# Altium schematic sheet IMX7S_DEBUG.SchDoc
size A3
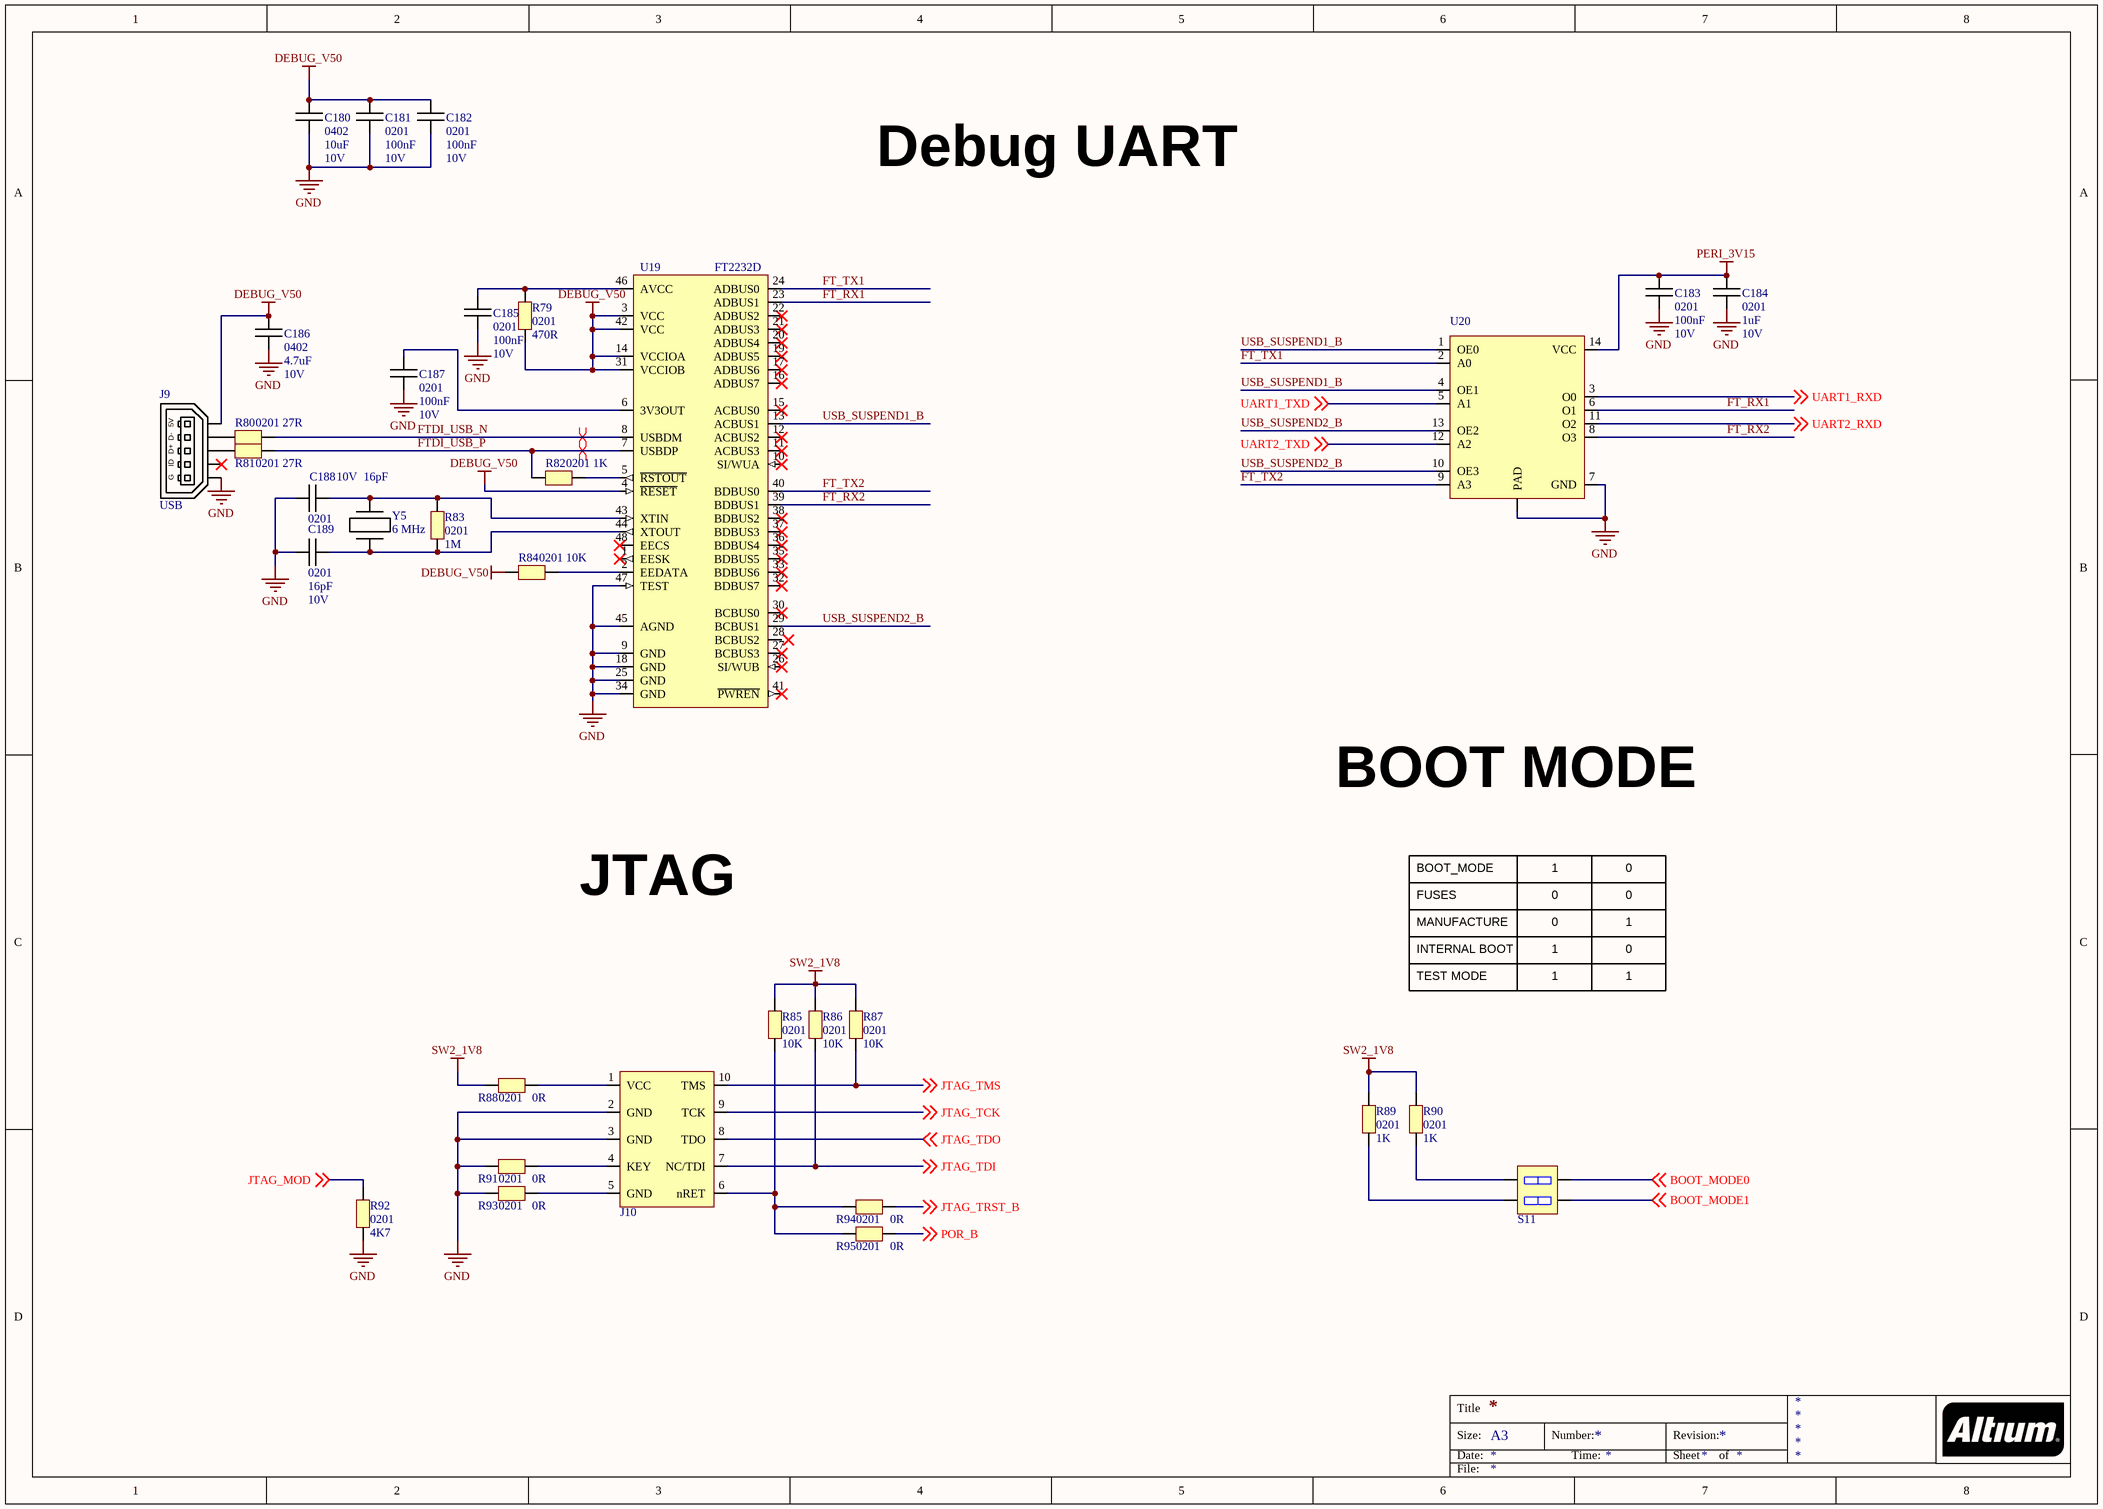
[diagram p0: IMX7S_DEBUG.SchDoc]

## Parts
C180  value 10uF  PACKAGE: 0402  VOLTAGE: 10V  [C0402]  (hidden comment: C0402)
C181  value 100nF  PACKAGE: 0201  VOLTAGE: 10V  [C0201]  (hidden comment: C0201)
C182  value 100nF  PACKAGE: 0201  VOLTAGE: 10V  [C0201]  (hidden comment: C0201)
C183  value 100nF  PACKAGE: 0201  VOLTAGE: 10V  [C0201]  (hidden comment: C0201)
C184  value 1uF  PACKAGE: 0201  VOLTAGE: 10V  [C0201]  (hidden comment: C0201)
C185  value 100nF  PACKAGE: 0201  VOLTAGE: 10V  [C0201]  (hidden comment: C0201)
C186  value 4.7uF  PACKAGE: 0402  VOLTAGE: 10V  [C0402]  (hidden comment: C0402)
C187  value 100nF  PACKAGE: 0201  VOLTAGE: 10V  [C0201]  (hidden comment: C0201)
C188  value 16pF  PACKAGE: 0201  VOLTAGE: 10V  [C0201]  (hidden comment: C0201)
C189  value 16pF  PACKAGE: 0201  VOLTAGE: 10V  [C0201]  (hidden comment: C0201)
J9  USB  [MICRO_USB]
J10  CONN_JTAG  [JTAG_CONN]  (value not drawn)
R79  value 470R  PACKAGE: 0201  [R0201]  (hidden comment: R0201)
R80  value 27R  PACKAGE: 0201  [R0201]  (hidden comment: R0201)
R81  value 27R  PACKAGE: 0201  [R0201]  (hidden comment: R0201)
R82  value 1K  PACKAGE: 0201  [R0201]  (hidden comment: R0201)
R83  value 1M  PACKAGE: 0201  [R0201]  (hidden comment: R0201)
R84  value 10K  PACKAGE: 0201  [R0201]  (hidden comment: R0201)
R85  value 10K  PACKAGE: 0201  [R0201]  (hidden comment: R0201)
R86  value 10K  PACKAGE: 0201  [R0201]  (hidden comment: R0201)
R87  value 10K  PACKAGE: 0201  [R0201]  (hidden comment: R0201)
R88  value 0R  PACKAGE: 0201  [R0201]  (hidden comment: R0201)
R89  value 1K  PACKAGE: 0201  [R0201]  (hidden comment: R0201)
R90  value 1K  PACKAGE: 0201  [R0201]  (hidden comment: R0201)
R91  value 0R  PACKAGE: 0201  [R0201]  (hidden comment: R0201)
R92  value 4K7  PACKAGE: 0201  [R0201]  (hidden comment: R0201)
R93  value 0R  PACKAGE: 0201  [R0201]  (hidden comment: R0201)
R94  value 0R  PACKAGE: 0201  [R0201]  (hidden comment: R0201)
R95  value 0R  PACKAGE: 0201  [R0201]  (hidden comment: R0201)
S11  mikroswitch  [DIP_SWITCH]  (value not drawn)
U19  FT2232D  [LQFP48]
U20  74LCX126BQX  [DQFN14]  (value not drawn)
Y5  6 MHz  [HC49]

## Nets
DEBUG_V50: C180.2 C181.2 C182.2 C186.2 J9.1(5V) R79.1 R84.2 U19.3(VCC) U19.4(~{RESET}) U19.14(VCCIOA) U19.31(VCCIOB) U19.42(VCC)
GND: C180.1 C181.1 C182.1 C183.1 C184.1 C185.1 C186.1 C187.1 C188.2 C189.2 J9.5(GND) J10.2(GND) J10.3(GND) R91.2 R92.2 R93.2 U19.9(GND) U19.18(GND) U19.25(GND) U19.34(GND) U19.45(AGND) U19.47(TEST) U20.0(PAD) U20.7(GND)
PERI_3V15: C183.2 C184.2 U20.14(VCC)
SW2_1V8: R85.2 R86.1 R87.1 R88.2 R89.2 R90.2
BOOT_MODE0: S11.4 ; off-sheet BOOT_MODE0
BOOT_MODE1: S11.3 ; off-sheet BOOT_MODE1
FT_RX1: U19.23(ADBUS1) U20.6(O1)
FT_RX2: U19.39(BDBUS1) U20.8(O3)
FT_TX1: U19.24(ADBUS0) U20.2(A0)
FT_TX2: U19.40(BDBUS0) U20.9(A3)
FTDI_USB_N: R80.1 U19.8(USBDM)
FTDI_USB_P: R81.1 R82.2 U19.7(USBDP)
JTAG_MOD: R92.1 ; off-sheet JTAG_MOD
JTAG_TCK: J10.9(TCK) ; off-sheet JTAG_TCK
JTAG_TDI: J10.7(NC/TDI) R86.2 ; off-sheet JTAG_TDI
JTAG_TDO: J10.8(TDO) ; off-sheet JTAG_TDO
JTAG_TMS: J10.10(TMS) R87.2 ; off-sheet JTAG_TMS
JTAG_TRST_B: R94.1 ; off-sheet JTAG_TRST_B
POR_B: R95.1 ; off-sheet POR_B
UART1_RXD: U20.3(O0) ; off-sheet UART1_RXD
UART1_TXD: U20.5(A1) ; off-sheet UART1_TXD
UART2_RXD: U20.11(O2) ; off-sheet UART2_RXD
UART2_TXD: U20.12(A2) ; off-sheet UART2_TXD
USB_SUSPEND1_B: U19.13(ACBUS1) U20.1(OE0) U20.4(OE1)
USB_SUSPEND2_B: U19.29(BCBUS1) U20.10(OE3) U20.13(OE2)
NetC185_2: C185.2 R79.2 U19.46(AVCC)
NetC187_2: C187.2 U19.6(3V3OUT)
NetC188_1: C188.1 R83.1 U19.43(XTIN) Y5.2
NetC189_1: C189.1 R83.2 U19.44(XTOUT) Y5.1
NetJ9_2: J9.2(D-) R80.2
NetJ9_3: J9.3(D+) R81.2
NetJ10_1: J10.1(VCC) R88.1
NetJ10_4: J10.4(KEY) R91.1
NetJ10_5: J10.5(GND) R93.1
NetJ10_6: J10.6(nRET) R85.1 R94.2 R95.2
NetR82_1: R82.1 U19.5(~{RSTOUT})
NetR84_1: R84.1 U19.2(EEDATA)
NetR89_1: R89.1 S11.2
NetR90_1: R90.1 S11.1

Not connected (* = marked no-connect by the designer): J9 4(ID)*; U19 1(EESK)* 10(SI/WUA)* 11(ACBUS3)* 12(ACBUS2)* 15(ACBUS0)* 16(ADBUS7)* 17(ADBUS6)* 19(ADBUS5)* 20(ADBUS4)* 21(ADBUS3)* 22(ADBUS2)* 26(SI/WUB)* 27(BCBUS3)* 28(BCBUS2) 30(BCBUS0)* 32(BDBUS7)* 33(BDBUS6)* 35(BDBUS5)* 36(BDBUS4)* 37(BDBUS3)* 38(BDBUS2)* 41(~{PWREN})* 48(EECS)*

## Layout directives
differential pair: FTDI_USB_N, FTDI_USB_P

## Notes on the sheet
- Debug UART
- BOOT MODE
- JTAG
- BOOT_MODE
- FUSES
- 1
- 0
- MANUFACTURE
- INTERNAL BOOT
- TEST MODE
- Title
- Size:
- Date:
- A3
- Number:
- Time:
- Revision:
- Sheet
- of
- File:
- (in symbol MICRO_USB) G

## Library data of the parts
C180 = C0402: Manufacturer 1: Murata; Manufacturer Part Number 1: GRM155R60J106ME44D; Description: Smd Multilayer Ceramic Capacitor, Grm Series, 10 F, 20%, X5r, 6.3 V, 0402 [1005 Metric]; Tolerance: 20%; Voltage Rating: 6.3V; Dielectric: X5R; Supplier 1: Farnell; Supplier Part Number 1: 2666402; Stock 1: 2120000; Pricing 1: 10000=0,05500, 50000=0,04130 (EUR); RoHS: Yes; Mount: Surface Mount; Case/Package: 0402; Case Code (Imperial): 0402; Case Code (Metric): 1005; Min Operating Temperature: -55°C; Max Operating Temperature: 85°C; Packaging: Tape and Reel; Package Quantity: 10000; Capacitance: 10uF; Voltage Rating (DC): 6.3V; Termination: SMD/SMT; Length: 1mm; Height: 0.5mm; Width: 0.5mm; Thickness: 0.022inch; Depth: 0.5mm; REACH SVHC: No SVHC; Lead Free: Lead Free; ComponentLink1URL: http://www.farnell.com/datasheets/1666664.pdf?src-supplier=Farnell; ComponentLink1Description: http://www.farnell.com/datasheets/1666664.pdf?src-supplier=Farnell; ComponentLink2URL: http://components.arrow.com/part/dataview/50476202S8987292N2606?src-supplier=Arrow; ComponentLink2Description: http://components.arrow.com/part/dataview/50476202S8987292N2606?src-supplier=Arrow; ComponentLink3URL: http://uk.rs-online.com/webdocs/13b3/0900766b813b3e5a.pdf?src-supplier=RSComponents; ComponentLink3Description: http://uk.rs-online.com/webdocs/13b3/0900766b813b3e5a.pdf?src-supplier=RSComponents; ComponentLink4URL: http://www.mouser.com/ds/2/281/c02e-2905.pdf?src-supplier=Mouser; ComponentLink4Description: http://www.mouser.com/ds/2/281/c02e-2905.pdf?src-supplier=Mouser; ComponentLink5URL: http://www.farnell.com/datasheets/1889704.pdf?src-supplier=Farnell; ComponentLink5Description: http://www.farnell.com/datasheets/1889704.pdf?src-supplier=Farnell; ComponentLink6URL: http://components.arrow.com/part/dataview/0323_07121522?src-supplier=Arrow+Europe; ComponentLink6Description: http://components.arrow.com/part/dataview/0323_07121522?src-supplier=Arrow+Europe; ComponentLink7URL: http://www.farnell.com/datasheets/1889704.pdf?src-supplier=Element14; ComponentLink7Description: http://www.farnell.com/datasheets/1889704.pdf?src-supplier=Element14; ComponentLink8URL: http://www.murata.com/en-global/about/newsroom/news/product/capacitor/2010/0510?src-supplier=Avnet; ComponentLink8Description: http://www.murata.com/en-global/about/newsroom/news/product/capacitor/2010/0510?src-supplier=Avnet; ComponentLink9URL: https://www.murata.com/~/media/webrenewal/support/library/catalog/products/capacitor/mlcc/c02e.ashx?la=en-us&src-supplier=Digi-Key; ComponentLink9Description: https://www.murata.com/~/media/webrenewal/support/library/catalog/products/capacitor/mlcc/c02e.ashx?la=en-us&src-supplier=Digi-Key; ComponentLink10URL: http://www.farnell.com/datasheets/1889704.pdf?src-supplier=Newark; ComponentLink10Description: http://www.farnell.com/datasheets/1889704.pdf?src-supplier=Newark
C181-C183 C185 C187 = C0201: Manufacturer 1: Murata; Manufacturer Part Number 1: GRM033R61A104KE15D; Description: CAP CER 0.1UF 10V X5R 0201; Dielectric: X5R; Tolerance: 10%; Supplier 1: Farnell; Supplier Part Number 1: 2666355; Stock 1: 2430000; Pricing 1: 15000=0,00510, 75000=0,00310 (EUR); RoHS: Yes; Mount: Surface Mount; Case/Package: 0201; Weight: 6E-06oz; Case Code (Metric): 0603; Case Code (Imperial): 0201; Min Operating Temperature: -55°C; Max Operating Temperature: 85°C; Packaging: Tape and Reel; Capacitance: 100nF; Package Quantity: 1; Voltage Rating (DC): 10V; Termination: SMD/SMT; Voltage Rating: 10V; Length: 0.6mm; Height: 0.3mm; Width: 0.012inch; Thickness: 0.013inch; Depth: 0.3mm; Radiation Hardening: No; REACH SVHC: No SVHC; Lead Free: Lead Free; ComponentLink1URL: https://datasheet.ciiva.com/26843/getdatasheetpartid-308656-26843739.pdf?src-supplier=Verical; ComponentLink1Description: https://datasheet.ciiva.com/26843/getdatasheetpartid-308656-26843739.pdf?src-supplier=Verical; ComponentLink2URL: https://datasheet.ciiva.com/5413/product-5413117.pdf?src-supplier=Mouser; ComponentLink2Description: https://datasheet.ciiva.com/5413/product-5413117.pdf?src-supplier=Mouser; ComponentLink3URL: https://datasheet.ciiva.com/6256/partnumbering-e-01-6256406.pdf?src-supplier=Digi-Key; ComponentLink3Description: https://datasheet.ciiva.com/6256/partnumbering-e-01-6256406.pdf?src-supplier=Digi-Key; ComponentLink4URL: https://datasheet.ciiva.com/6256/partnumbering-e-01-6256408.pdf?src-supplier=Digi-Key; ComponentLink4Description: https://datasheet.ciiva.com/6256/partnumbering-e-01-6256408.pdf?src-supplier=Digi-Key; ComponentLink5URL: https://datasheet.ciiva.com/6256/partnumbering-e-01-6256407.pdf?src-supplier=Digi-Key; ComponentLink5Description: https://datasheet.ciiva.com/6256/partnumbering-e-01-6256407.pdf?src-supplier=Digi-Key
C184 = C0201: Manufacturer 1: Murata; Manufacturer Part Number 1: GRM033R60J105MEA2D; Description: CAP CER 1UF 6.3V X5R 0201; Tolerance: 20%; Voltage Rating: 6.3V; Dielectric: X5R; Supplier 1: Farnell; Supplier Part Number 1: 2666353; Stock 1: 165000; Pricing 1: 15000=0,01430, 75000=0,01240 (EUR); RoHS: Yes; Mount: Surface Mount; Case/Package: 0201; Weight: 1.2E-05oz; Case Code (Imperial): 0201; Case Code (Metric): 0603; Min Operating Temperature: -55°C; Max Operating Temperature: 85°C; Package Quantity: 1; Packaging: Cut Tape; Capacitance: 1uF; Voltage Rating (DC): 6.3V; Termination: SMD/SMT; Length: 0.6mm; Height: 0.3mm; Width: 0.3mm; Depth: 0.3mm; Thickness: 300um; REACH SVHC: No SVHC; Lead Free: Lead Free; ComponentLink1URL: https://datasheet.ciiva.com/18699/grm033r60j105mea2-02-18699520.pdf?src-supplier=Digi-Key; ComponentLink1Description: https://datasheet.ciiva.com/18699/grm033r60j105mea2-02-18699520.pdf?src-supplier=Digi-Key; ComponentLink2URL: https://datasheet.ciiva.com/24218/c02e-24218376.pdf?src-supplier=Mouser; ComponentLink2Description: https://datasheet.ciiva.com/24218/c02e-24218376.pdf?src-supplier=Mouser; ComponentLink3URL: https://datasheet.ciiva.com/18699/partnumbering-e-01-18699519.pdf?src-supplier=Digi-Key; ComponentLink3Description: https://datasheet.ciiva.com/18699/partnumbering-e-01-18699519.pdf?src-supplier=Digi-Key
C186 = C0402: Manufacturer 1: Murata; Manufacturer Part Number 1: GRM155R61A475MEAAD; Description: 0402 10 V 4.7 uF ±20% Tolerance X5R Multilayer Ceramic Chip Capacitor; Supplier 1: Farnell; Supplier Part Number 1: 2688503; Stock 1: 566816; Pricing 1: 10=0,19300, 100=0,08330, 500=0,05910, 2500=0,04130, 5000=0,03540, 10000=0,02750, 50000=0,02700 (EUR); Case/Package: 0402; ComponentLink1URL: http://www.farnell.com/datasheets/2189109.pdf?src-supplier=Farnell; ComponentLink1Description: http://www.farnell.com/datasheets/2189109.pdf?src-supplier=Farnell; ComponentLink2URL: https://search.murata.co.jp/Ceramy/image/img/A01X/G101/ENG/GRM155R61A475MEAA-01.pdf?src-supplier=Digi-Key; ComponentLink2Description: https://search.murata.co.jp/Ceramy/image/img/A01X/G101/ENG/GRM155R61A475MEAA-01.pdf?src-supplier=Digi-Key; ComponentLink3URL: http://datasheet.octopart.com/GRM155R61A475MEAAD-Murata-datasheet-68589269.pdf?src-supplier=Newark; ComponentLink3Description: http://datasheet.octopart.com/GRM155R61A475MEAAD-Murata-datasheet-68589269.pdf?src-supplier=Newark; ComponentLink4URL: http://datasheet.octopart.com/GRM155R61A475MEAAD-Murata-datasheet-8819587.pdf; ComponentLink4Description: http://datasheet.octopart.com/GRM155R61A475MEAAD-Murata-datasheet-8819587.pdf; ComponentLink5URL: http://datasheet.octopart.com/GRM155R61A475MEAAD-Murata-datasheet-10025737.pdf; ComponentLink5Description: http://datasheet.octopart.com/GRM155R61A475MEAAD-Murata-datasheet-10025737.pdf; ComponentLink6URL: http://datasheet.octopart.com/GRM155R61A475MEAAD-Murata-datasheet-11978611.pdf; ComponentLink6Description: http://datasheet.octopart.com/GRM155R61A475MEAAD-Murata-datasheet-11978611.pdf; ComponentLink7URL: http://datasheet.octopart.com/GRM155R61A475MEAAD-Murata-datasheet-12510076.pdf; ComponentLink7Description: http://datasheet.octopart.com/GRM155R61A475MEAAD-Murata-datasheet-12510076.pdf; ComponentLink8URL: http://datasheet.octopart.com/GRM155R61A475MEAAD-Murata-datasheet-12515295.pdf; ComponentLink8Description: http://datasheet.octopart.com/GRM155R61A475MEAAD-Murata-datasheet-12515295.pdf
C188 C189 = C0201: Manufacturer 1: Murata; Manufacturer Part Number 1: GRM0335C1H160JA01D; Description: Multilayer Ceramic Capacitors MLCC - SMD/SMT 0201 16pF 50volts C0G +/-5%; Tolerance: 5%; Voltage Rating: 50V; Supplier 1: Farnell; Supplier Part Number 1: 2990622; Stock 1: 11750; Pricing 1: 10=0,01490, 100=0,00900, 500=0,00620, 2500=0,00410, 7500=0,00350, 15000=0,00310, 75000=0,00200 (EUR); RoHS: Yes; Mount: Surface Mount; Case/Package: 0201; Case Code (Imperial): 0201; Case Code (Metric): 0603; Min Operating Temperature: -55°C; Max Operating Temperature: 125°C; Packaging: Tape and Reel; Termination: SMD/SMT; Package Quantity: 15000; Capacitance: 16pF; Voltage Rating (DC): 50V; Length: 0.024inch; Width: 0.012inch; Thickness: 0.013inch; ComponentLink1URL: https://datasheet.ciiva.com/29538/grm0335c1h160ja01-01-29538813.pdf?src-supplier=Digi-Key; ComponentLink1Description: https://datasheet.ciiva.com/29538/grm0335c1h160ja01-01-29538813.pdf?src-supplier=Digi-Key
J9 = MICRO_USB
R79 = R0201: Manufacturer 1: Multicomp; Manufacturer Part Number 1: MCRE000132; VOLTAGE: 0V; Description: MULTICOMP   MCRE000132   Surface Mount Chip Resistor, Thick Film, MCRE Series, 470 ohm, 50 mW,  1%, 25 V; Tolerance: 1%; Voltage Rating: 25V; Temperature Coefficient: 200ppm/°C; Power Rating: 50mW; Supplier 1: Farnell; Supplier Part Number 1: 2130032; Stock 1: 60000; Pricing 1: 15000=0,00320, 75000=0,00290, 150000=0,00260 (EUR); RoHS: Yes; Case/Package: SMD/SMT; Case Code (Metric): 0603; Case Code (Imperial): 0201; Min Operating Temperature: -55°C; Max Operating Temperature: 125°C; Resistance: 470R; Packaging: Tape and Reel; Composition: Thick Film; Voltage Rating (DC): 25V; Width: 0.6mm; REACH SVHC: No SVHC; ComponentLink1URL: https://datasheet.ciiva.com/7881/1729044-7881559.pdf?src-supplier=Element14; ComponentLink1Description: https://datasheet.ciiva.com/7881/1729044-7881559.pdf?src-supplier=Element14; ComponentLink2URL: https://datasheet.ciiva.com/7881/1729044-7881560.pdf?src-supplier=Element14; ComponentLink2Description: https://datasheet.ciiva.com/7881/1729044-7881560.pdf?src-supplier=Element14; ComponentLink3URL: https://datasheet.ciiva.com/22707/1729044-22707629.pdf?src-supplier=Element14; ComponentLink3Description: https://datasheet.ciiva.com/22707/1729044-22707629.pdf?src-supplier=Element14
R80 R81 = R0201: Manufacturer 1: Vishay; Manufacturer Part Number 1: CRCW020127R0FNED; VOLTAGE: 0V; Description: RES SMD 27 OHM 1% 1/20W 0201; Power Rating: 50mW; Tolerance: 1%; Voltage Rating: 30V; Temperature Coefficient: 200ppm/°C; Supplier 1: Farnell; Supplier Part Number 1: 2139864; Stock 1: 6226; Pricing 1: 10=0,01240, 100=0,00930, 500=0,00760, 2500=0,00600, 5000=0,00560 (EUR); RoHS: Yes; Case/Package: 0201; Weight: 6E-06oz; Case Code (Imperial): 0201; Case Code (Metric): 0603; Contact Plating: Tin; Min Operating Temperature: -55°C; Max Operating Temperature: 155°C; Resistance: 27R; Packaging: Tape and Reel; Package Quantity: 10000; Composition: Thick Film; Number of Terminations: 2; Military Standard: Not; Max Power Dissipation: 50mW; Voltage Rating (DC): 30V; Length: 0.6mm; Height: 0.011inch; Width: 0.3mm; Depth: 0.3mm; Radiation Hardening: No; REACH SVHC: Unknown; Lead Free: Lead Free; ComponentLink1URL: https://datasheet.ciiva.com/7672/1719906-7672730.pdf?src-supplier=Element14; ComponentLink1Description: https://datasheet.ciiva.com/7672/1719906-7672730.pdf?src-supplier=Element14; ComponentLink2URL: https://datasheet.ciiva.com/7672/1719906-7672731.pdf?src-supplier=Element14; ComponentLink2Description: https://datasheet.ciiva.com/7672/1719906-7672731.pdf?src-supplier=Element14; ComponentLink3URL: https://datasheet.ciiva.com/9022/crcw0201e3-9022380.pdf?src-supplier=Avnet; ComponentLink3Description: https://datasheet.ciiva.com/9022/crcw0201e3-9022380.pdf?src-supplier=Avnet; ComponentLink4URL: https://datasheet.ciiva.com/2580/crcw0201e3-2580093.pdf?src-supplier=Digi-Key; ComponentLink4Description: https://datasheet.ciiva.com/2580/crcw0201e3-2580093.pdf?src-supplier=Digi-Key
R82 = R0201: Manufacturer 1: Multicomp; Manufacturer Part Number 1: MCWR02X1001FAL; VOLTAGE: 0V; Description: MULTICOMP         MCWR02X1001FAL             SMD Chip Resistor, Thick Film, 1 kohm, 25 V, 0201 [0603 Metric], 50 mW,  1%, MCWR Series; Voltage Rating: 25V; Resistance: 1kR; Power Rating: 50mW; Tolerance: 1%; Temperature Coefficient: 100ppm/°C; Supplier 1: Farnell; Supplier Part Number 1: 2447064; Stock 1: 75000; Pricing 1: 15000=0,00230, 75000=0,00210, 150000=0,00190 (EUR); RoHS: No; Case/Package: 0201; Case Code (Metric): 0603; Case Code (Imperial): 0201; Packaging: Cut Tape; Composition: Thick Film; Voltage Rating (DC): 25V; REACH SVHC: No SVHC; ComponentLink1URL: http://www.farnell.com/datasheets/1849611.pdf?src-supplier=Element14; ComponentLink1Description: http://www.farnell.com/datasheets/1849611.pdf?src-supplier=Element14
R83 = R0201: Manufacturer 1: Multicomp; Manufacturer Part Number 1: MCRE000239; VOLTAGE: 0V; Description: RESISTOR, 0201, 1M1, 1%; Resistance: 1.1MR; Power Rating: 50mW; Tolerance: 1%; Voltage Rating: 25V; Temperature Coefficient: 200ppm/°C; Supplier 1: Farnell; Supplier Part Number 1: 2141390; Stock 1: 9030; Pricing 1: 10=0,01950, 100=0,01250, 500=0,00970, 2500=0,00790, 7500=0,00680 (EUR); RoHS: Yes; Case/Package: 0201; Case Code (Metric): 0603; Case Code (Imperial): 0201; Packaging: Tape and Reel; Composition: Thick Film; Voltage Rating (DC): 25V; REACH SVHC: Yes; ComponentLink1URL: http://www.farnell.com/datasheets/1729044.pdf?src-supplier=Element14; ComponentLink1Description: http://www.farnell.com/datasheets/1729044.pdf?src-supplier=Element14
R84-R87 = R0201: Manufacturer 1: Multicomp; Manufacturer Part Number 1: MCRE000164; VOLTAGE: 0V; Description: MULTICOMP   MCRE000164   Surface Mount Chip Resistor, Thick Film, MCRE Series, 10 kohm, 50 mW,  1%, 25 V; Resistance: 10kR; Tolerance: 1%; Temperature Coefficient: 200ppm/°C; Power Rating: 50mW; Voltage Rating: 25V; Supplier 1: Farnell; Supplier Part Number 1: 1711641; Stock 1: 137013; Pricing 1: 10=0,01690, 100=0,01010, 500=0,00720, 2500=0,00570, 7500=0,00460 (EUR); RoHS: Yes; Case/Package: SMD/SMT; Case Code (Metric): 0603; Case Code (Imperial): 0201; Min Operating Temperature: -55°C; Max Operating Temperature: 125°C; Packaging: Cut Tape; Composition: Thick Film; Voltage Rating (DC): 25V; Width: 0.6mm; REACH SVHC: No SVHC; ComponentLink1URL: https://datasheet.ciiva.com/7881/1729044-7881565.pdf?src-supplier=Element14; ComponentLink1Description: https://datasheet.ciiva.com/7881/1729044-7881565.pdf?src-supplier=Element14; ComponentLink2URL: https://datasheet.ciiva.com/46391/1636793-46391341.pdf?src-supplier=Element14; ComponentLink2Description: https://datasheet.ciiva.com/46391/1636793-46391341.pdf?src-supplier=Element14; ComponentLink3URL: https://datasheet.ciiva.com/7881/1729044-7881566.pdf?src-supplier=Element14; ComponentLink3Description: https://datasheet.ciiva.com/7881/1729044-7881566.pdf?src-supplier=Element14
R88 R91 R93-R95 = R0201: Manufacturer 1: Multicomp; Manufacturer Part Number 1: MCRE000086; VOLTAGE: 0V; Description: MULTICOMP - MCRE000086 - RES, 0R0, 1%, 0.05W, 0201, THICK FILM; Voltage Rating (DC): 25V; Resistance: 0mR; Tolerance: 1%; Power Rating: 50mW; Temperature Coefficient: 200ppm/°C; Supplier 1: Farnell; Supplier Part Number 1: 1711553; Stock 1: 101950; Pricing 1: 10=0,01820, 100=0,01090, 500=0,00780, 2500=0,00610, 5000=0,00490 (EUR); RoHS: Yes; Case/Package: SMD/SMT; Case Code (Metric): 0603; Case Code (Imperial): 0201; Min Operating Temperature: -55°C; Max Operating Temperature: 125°C; Packaging: Cut Tape; Voltage Rating: 25V; Composition: Thick Film; Width: 0.6mm; REACH SVHC: No SVHC; ComponentLink1URL: https://datasheet.ciiva.com/7777/1662352-7777045.pdf?src-supplier=Element14; ComponentLink1Description: https://datasheet.ciiva.com/7777/1662352-7777045.pdf?src-supplier=Element14
R89 R90 = R0201: Manufacturer 1: Multicomp; Manufacturer Part Number 1: MCWR02X1001FAL; VOLTAGE: 0V; Description: MULTICOMP         MCWR02X1001FAL             SMD Chip Resistor, Thick Film, 1 kohm, 25 V, 0201 [0603 Metric], 50 mW,  1%, MCWR Series; Tolerance: 1%; Voltage Rating (DC): 25V; Resistance: 1kR; Power Rating: 50mW; Temperature Coefficient: 100ppm/°C; Supplier 1: Farnell; Supplier Part Number 1: 2447064; Stock 1: 75000; Pricing 1: 15000=0,00230, 75000=0,00210, 150000=0,00190 (EUR); RoHS: No; Case/Package: 0201; Case Code (Metric): 0603; Case Code (Imperial): 0201; Packaging: Cut Tape; Voltage Rating: 25V; Composition: Thick Film; REACH SVHC: No SVHC; ComponentLink1URL: http://www.farnell.com/datasheets/1849611.pdf?src-supplier=Element14; ComponentLink1Description: http://www.farnell.com/datasheets/1849611.pdf?src-supplier=Element14
R92 = R0201: Manufacturer 1: Vishay; Manufacturer Part Number 1: CRCW02014K70FNED; VOLTAGE: 0V; Description: RES SMD 4.7K OHM 1% 1/20W 0201; Voltage Rating: 30V; Resistance: 4.7kR; Tolerance: 1%; Power Rating: 50mW; Temperature Coefficient: 200ppm/°C; Supplier 1: Farnell; Supplier Part Number 1: 2120925; Stock 1: 100000; Pricing 1: 10000=0,00510, 50000=0,00430, 100000=0,00420 (EUR); RoHS: Yes; Case/Package: 0201; Contact Plating: Tin; Case Code (Metric): 0603; Case Code (Imperial): 0201; Min Operating Temperature: -55°C; Max Operating Temperature: 155°C; Packaging: Tape and Reel; Composition: Thick Film; Military Standard: Not; Voltage Rating (DC): 30V; Length: 0.6mm; Depth: 0.3mm; Radiation Hardening: No; REACH SVHC: Unknown; Lead Free: Lead Free; ComponentLink1URL: https://datasheet.ciiva.com/8079/1719906-8079639.pdf?src-supplier=Element14; ComponentLink1Description: https://datasheet.ciiva.com/8079/1719906-8079639.pdf?src-supplier=Element14; ComponentLink2URL: https://datasheet.ciiva.com/8079/1719906-8079640.pdf?src-supplier=Element14; ComponentLink2Description: https://datasheet.ciiva.com/8079/1719906-8079640.pdf?src-supplier=Element14; ComponentLink3URL: https://datasheet.ciiva.com/22682/1700795-22682633.pdf?src-supplier=Element14; ComponentLink3Description: https://datasheet.ciiva.com/22682/1700795-22682633.pdf?src-supplier=Element14; ComponentLink4URL: https://datasheet.ciiva.com/22700/1719906-22700348.pdf?src-supplier=Element14; ComponentLink4Description: https://datasheet.ciiva.com/22700/1719906-22700348.pdf?src-supplier=Element14
S11 = mikroswitch: Manufacturer 1: TE Connectivity; Manufacturer Part Number 1: 1571983-1; Actuator Material: Polymer; Throw Configuration: SPST; Contact Resistance: 100mR; Contact Current Rating: 100mA; Number of Positions: 2; Actuator Type: Standard; Voltage Rating (DC): 50V; Max Voltage Rating (DC): 24V; Switching Capacity: 400mW; Electrical Life: 1000Cycles; Max Current Rating: 25mA; Sealable: Yes (With); Test Voltage: 300V; Actuator Length: 0mm; Pitch: 1.27mm; Washable: Yes; Supplier 1: Farnell; Supplier Part Number 1: 1123952; Stock 1: 3281; Pricing 1: 1=1,34000, 50=1,30000, 100=1,17000, 500=0,99600, 1000=0,77700 (EUR); RoHS: Yes; Mount: Surface Mount; Number of Pins: 2; Contact Material: Copper Alloy; Contact Plating: Gold; Housing Color: Black; Housing Material: Polyphenylene; Min Operating Temperature: -30°C; Max Operating Temperature: 85°C; Package Quantity: 125; Packaging: Tape and Reel; Termination: Gull Wing; Orientation: Straight; Number of Poles: 2; Type: Switch; Length: 0.144inch; Height: 7.31mm; Width: 8.13mm; Terminal Pitch: 1.27mm; Depth: 8.13mm; Radiation Hardening: No; Lead Free: Lead Free; Flammability Rating: UL94 V-0; ELV: Compliant; ComponentLink1URL: https://datasheet.ciiva.com/29119/701643-da-01-en-dip-schalter-2pol-gdh02s04-29119728.pdf?src-supplier=Conrad; ComponentLink1Description: https://datasheet.ciiva.com/29119/701643-da-01-en-dip-schalter-2pol-gdh02s04-29119728.pdf?src-supplier=Conrad; ComponentLink2URL: https://datasheet.ciiva.com/16361/eng-cs-1308111-1-switches-core-program-catalog-0308-16361994.pdf?src-supplier=Future+Electronics; ComponentLink2Description: https://datasheet.ciiva.com/16361/eng-cs-1308111-1-switches-core-program-catalog-0308-16361994.pdf?src-supplier=Future+Electronics; ComponentLink3URL: https://datasheet.ciiva.com/30134/eng-cd-1571983-b-30134091.pdf?src-supplier=Onlinecomponents.com; ComponentLink3Description: https://datasheet.ciiva.com/30134/eng-cd-1571983-b-30134091.pdf?src-supplier=Onlinecomponents.com; ComponentLink4URL: https://datasheet.ciiva.com/15184/getdatasheetpartid-237177-15184941.pdf?src-supplier=Verical; ComponentLink4Description: https://datasheet.ciiva.com/15184/getdatasheetpartid-237177-15184941.pdf?src-supplier=Verical; ComponentLink5URL: https://datasheet.ciiva.com/25890/eng-cs-1308111-1-switches-core-program-catalog-0308-25890601.pdf?src-supplier=Avnet+Europe; ComponentLink5Description: https://datasheet.ciiva.com/25890/eng-cs-1308111-1-switches-core-program-catalog-0308-25890601.pdf?src-supplier=Avnet+Europe
U19 = FT2232D: USB Full Speed to Dual Channel Serial UART/FIFO/JTAG/SPI/I2C IC - LQFP-48; MF: FTDI,; MP: FT2232D-REEL; SnapEDA_Link: https://www.snapeda.com/parts/FT2232D-REEL/FTDI%2C%20Future%20Technology%20Devices%20International%20Ltd/view-part/?ref=snap; Package: LQFP-48 FTDI; Digi-Key_Purchase_URL: https://www.digikey.com/product-detail/en/ftdi-future-technology-devices-international-ltd/FT2232D-REEL/768-1010-1-ND/1836405?utm_source=snapeda&utm_medium=aggregator&utm_campaign=symbol; Digi-Key_Part_Number: 768-1010-1-ND; Value: *
U20 = 74LCX126BQX: Manufacturer 1: ON Semiconductor / Fairchild; Description: IC BUFFER QUAD LV N-INV 14DQFN; Number of Channels: 4; Max Supply Voltage: 3.6V; Min Supply Voltage: 2V; Propagation Delay: 7.8ns; Logic Function: Buffer,Inverting; Low Level Output Current: 24mA; Polarity: Non-Inverting; Number of Bits per Element: 1; High Level Output Current: -24mA; Quiescent Current: 10uA; Supplier 1: Digi-Key; Supplier Part Number 1: 74LCX126BQXCT-ND; Manufacturer Part Number 1: 74LCX126BQX; Stock 1: 580; Pricing 1: 1=0,85000, 10=0,74400, 100=0,57020, 500=0,45072, 1000=0,36058 (USD); RoHS: Yes; Mount: Surface Mount; Number of Pins: 14; Weight: 0.12g; Contact Plating: Gold; Min Operating Temperature: -40°C; Max Operating Temperature: 85°C; Number of Inputs: 4; Number of Outputs: 4; Packaging: Tape and Reel; Package Quantity: 3000; Number of Elements: 4; Number of Input Lines: 4; Number of Output Lines: 4; Turn-On Delay Time: 7.8ns; Number of Bits: 4; Radiation Hardening: No; Lead Free: Lead Free; ComponentLink1URL: https://datasheet.ciiva.com/26861/74lcx126bqx-26861526.pdf?src-supplier=IIIC; ComponentLink1Description: https://datasheet.ciiva.com/26861/74lcx126bqx-26861526.pdf?src-supplier=IIIC; ComponentLink2URL: https://datasheet.ciiva.com/1837/74lcx126-1837157.pdf?src-supplier=Digi-Key; ComponentLink2Description: https://datasheet.ciiva.com/1837/74lcx126-1837157.pdf?src-supplier=Digi-Key; ComponentLink3URL: https://datasheet.ciiva.com/1837/74lcx126-1837158.pdf?src-supplier=Digi-Key; ComponentLink3Description: https://datasheet.ciiva.com/1837/74lcx126-1837158.pdf?src-supplier=Digi-Key; ComponentLink4URL: https://datasheet.ciiva.com/1837/74lcx126-1837156.pdf?src-supplier=Digi-Key; ComponentLink4Description: https://datasheet.ciiva.com/1837/74lcx126-1837156.pdf?src-supplier=Digi-Key; ComponentLink5URL: https://datasheet.ciiva.com/8306/74lcx126-8306053.pdf?src-supplier=Avnet; ComponentLink5Description: https://datasheet.ciiva.com/8306/74lcx126-8306053.pdf?src-supplier=Avnet; ComponentLink6URL: https://datasheet.ciiva.com/28425/74lcx126-28425643.pdf?src-supplier=Avnet+Europe; ComponentLink6Description: https://datasheet.ciiva.com/28425/74lcx126-28425643.pdf?src-supplier=Avnet+Europe
Y5 = QUARTZ_6MHz: Supplier 1: Farnell; Supplier Part Number 1: 2449403
J10 = CONN_JTAG: Supplier 1: Farnell; Supplier Part Number 1: 2112432